# EAGLE design IMU_v0_1 (EAGLE 5.10)
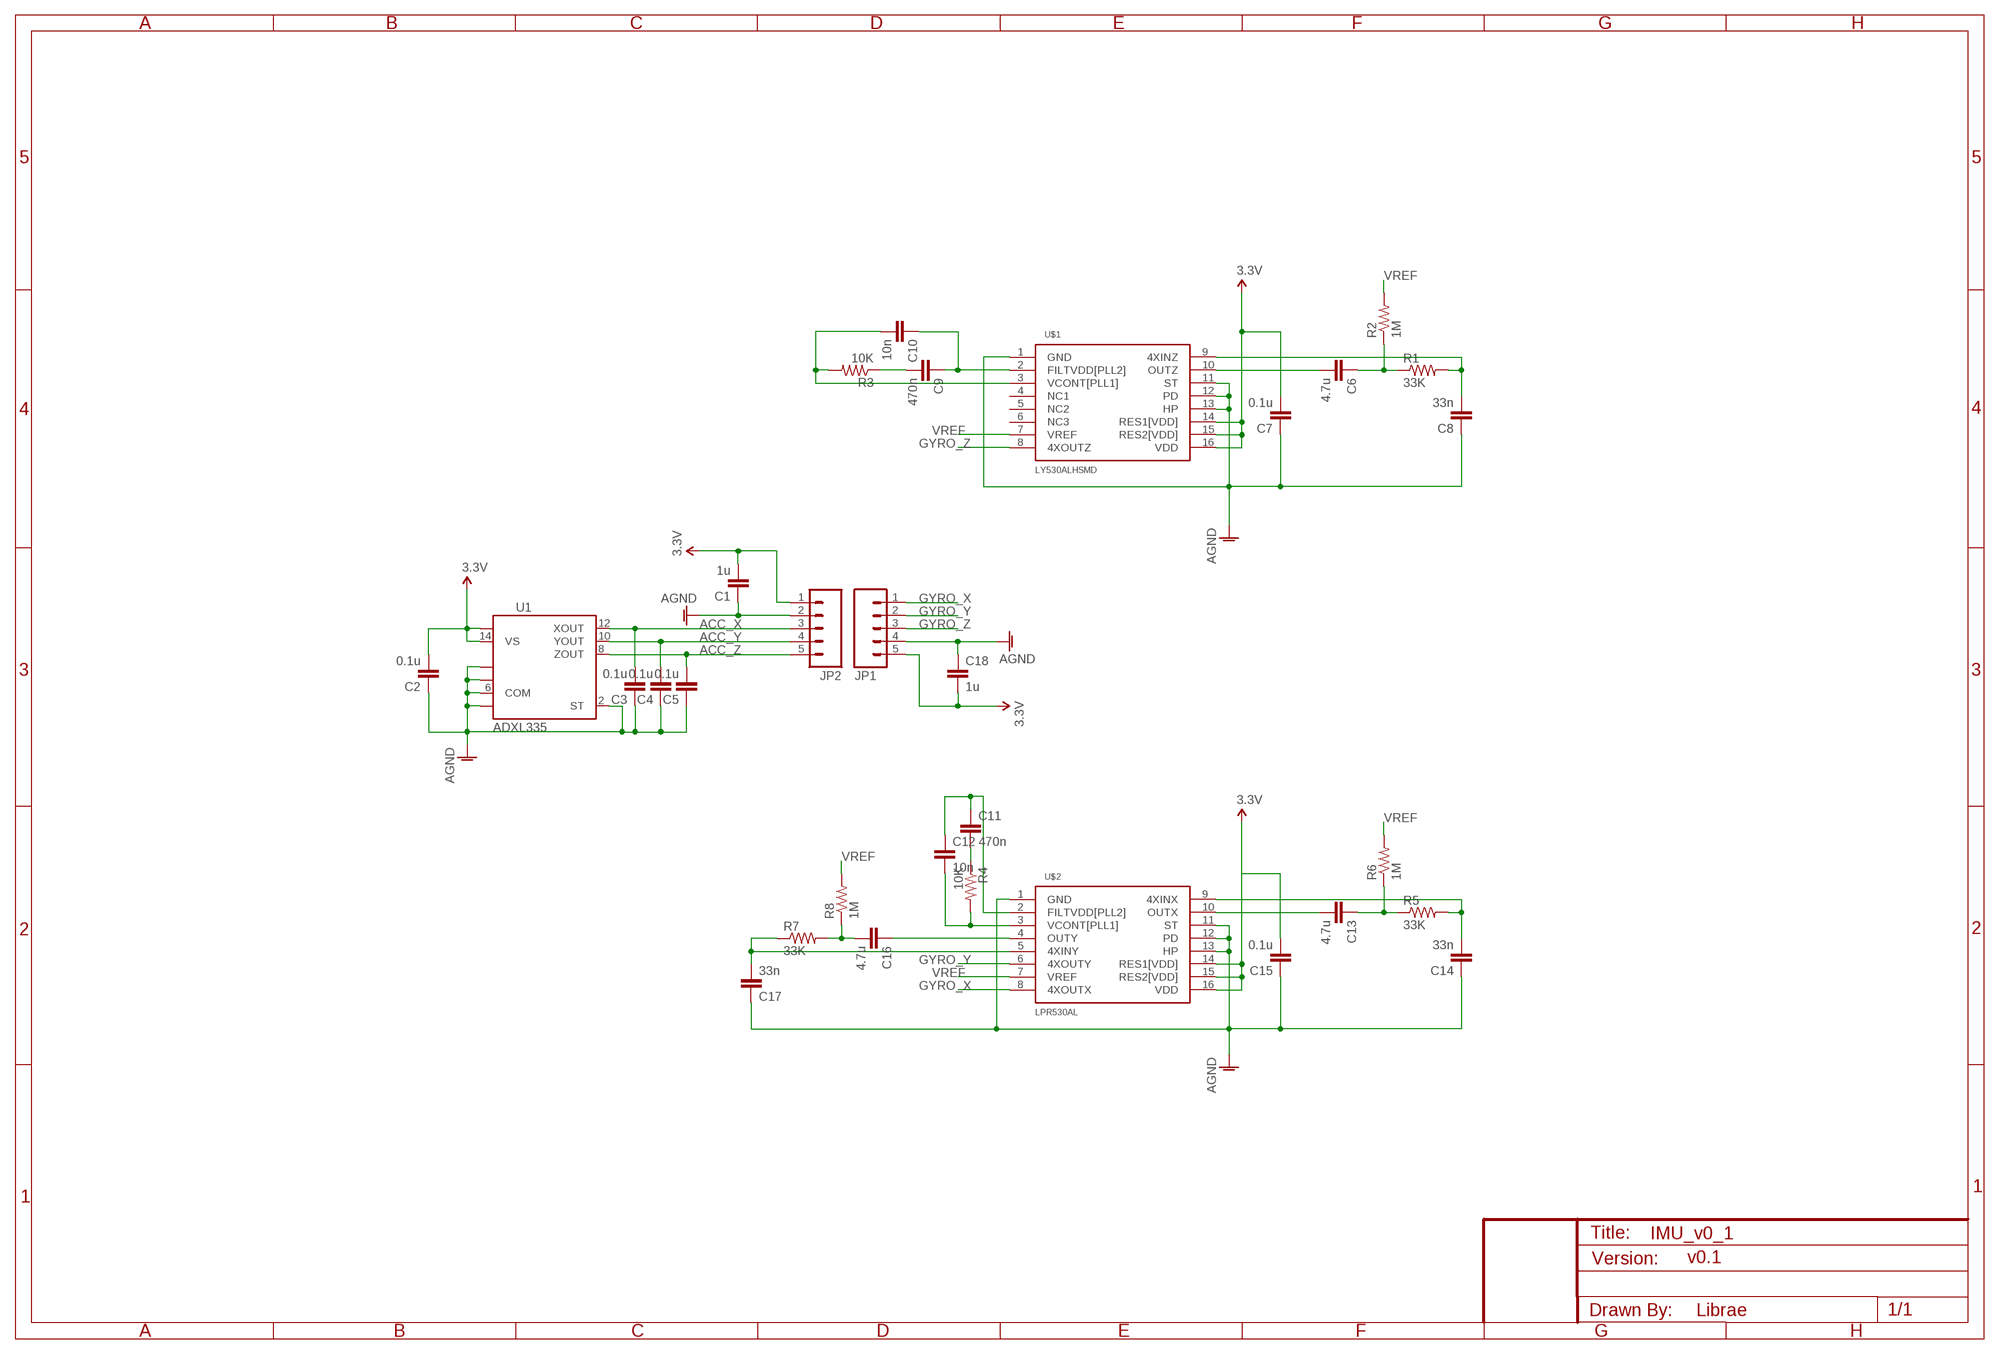
[diagram p0: schematic, sheet 1]

## Parts
C1  1u  CAP0805  [0805]
C2  0.1u  CAP0603-CAP  [0603-CAP]
C3  0.1u  CAP0603-CAP  [0603-CAP]
C4  0.1u  CAP0603-CAP  [0603-CAP]
C5  0.1u  CAP0603-CAP  [0603-CAP]
C6  4.7u  CAP0603-CAP  [0603-CAP]
C7  0.1u  CAP0603-CAP  [0603-CAP]
C8  33n  CAP0603-CAP  [0603-CAP]
C9  470n  CAP0603-CAP  [0603-CAP]
C10  10n  CAP0603-CAP  [0603-CAP]
C11  470n  CAP0603-CAP  [0603-CAP]
C12  10n  CAP0603-CAP  [0603-CAP]
C13  4.7u  CAP0603-CAP  [0603-CAP]
C14  33n  CAP0603-CAP  [0603-CAP]
C15  0.1u  CAP0603-CAP  [0603-CAP]
C16  4.7u  CAP0603-CAP  [0603-CAP]
C17  33n  CAP0603-CAP  [0603-CAP]
C18  1u  CAP0805  [0805]
JP1  M05PTH  [1X05]
JP2  M05PTH  [1X05]
R1  33K  RESISTOR0603-RES  [0603-RES]
R2  1M  RESISTOR0603-RES  [0603-RES]
R3  10K  RESISTOR0603-RES  [0603-RES]
R4  10K  RESISTOR0603-RES  [0603-RES]
R5  33K  RESISTOR0603-RES  [0603-RES]
R6  1M  RESISTOR0603-RES  [0603-RES]
R7  33K  RESISTOR0603-RES  [0603-RES]
R8  1M  RESISTOR0603-RES  [0603-RES]
U1  ADXL335  [LFCSP-16]
U$1  LY530ALHSMD  [LGA16]
U$2  LPR530AL  [LGA16-LPR530ALH]

## Nets
3.3V: C1.2 C2.2 C7.2 C15.2 C18.2 JP1.5 JP2.1 U1.14(VS) U1.15(VS) U$1.14(RES1[VDD]) U$1.15(RES2[VDD]) U$1.16(VDD) U$2.14(RES1[VDD]) U$2.15(RES2[VDD]) U$2.16(VDD)
ACC_X: C3.2 JP2.3 U1.12(XOUT)
ACC_Y: C4.2 JP2.4 U1.10(YOUT)
ACC_Z: C5.2 JP2.5 U1.8(ZOUT)
AGND: C1.1 C2.1 C3.1 C4.1 C5.1 C7.1 C8.1 C14.1 C15.1 C17.1 C18.1 JP1.4 JP2.2 U1.2(ST) U1.3(COM) U1.5(COM) U1.6(COM) U1.7(COM) U$1.1(GND) U$1.11(ST) U$1.12(PD) U$1.13(HP) U$2.1(GND) U$2.11(ST) U$2.12(PD) U$2.13(HP)
GYRO_X: JP1.1 U$2.8(4XOUTX)
GYRO_Y: JP1.2 U$2.6(4XOUTY)
GYRO_Z: JP1.3 U$1.8(4XOUTZ)
N$1: C8.2 R1.2 U$1.9(4XINZ)
N$3: C6.2 U$1.10(OUTZ)
N$4: C6.1 R1.1 R2.1
N$5: C11.1 C12.1 U$2.2(FILTVDD[PLL2])
N$7: C9.1 C10.1 U$1.2(FILTVDD[PLL2])
N$8: C9.2 R3.1
N$9: C10.2 R3.2 U$1.3(VCONT[PLL1])
N$10: C11.2 R4.1
N$11: C12.2 R4.2 U$2.3(VCONT[PLL1])
N$12: C13.2 U$2.10(OUTX)
N$13: C13.1 R5.1 R6.1
N$14: C14.2 R5.2 U$2.9(4XINX)
N$15: C16.1 U$2.4(OUTY)
N$16: C16.2 R7.2 R8.1
N$17: C17.2 R7.1 U$2.5(4XINY)
VREF: R2.2 R6.2 R8.2 U$1.7(VREF) U$2.7(VREF)
Unconnected: U$1.4(NC1) U$1.5(NC2) U$1.6(NC3)

## Notes on the sheet
- v0.1
- Librae

## Library data of the parts
C1-C18 = SparkFun:CAP: Capacitor Standard 0603 ceramic capacitor, and 0.1" leaded capacitor.
JP1 JP2 = SparkFun:M05: Header 5 Standard 5-pin 0.1" header. Use with straight break away headers (SKU : PRT-00116), right angle break away headers (PRT-00553), swiss pins (PRT-00743), machine pins (PRT-00117), and female headers (PRT-00115). Molex polarized connector foot print use with SKU : PRT-08230 with associated crimp pins and housings.
R1-R8 = MyLib:RESISTOR: Resistor Basic schematic elements and footprints for 0603, 1206, and PTH 1/10th watt (small) resistors.
U1 = MyLib:ADXL335
U$1 = MyLib:LY530ALH: LY530ALH
U$2 = MyLib:LPR530AL: LPR530AL

## Board
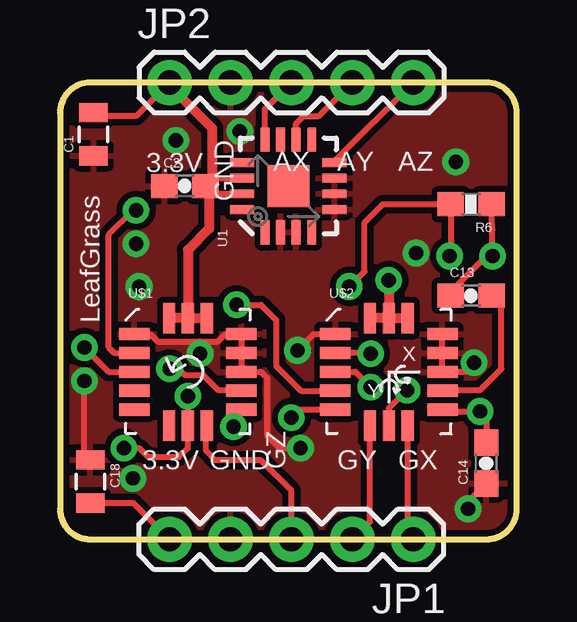
[diagram p1: board, top side]
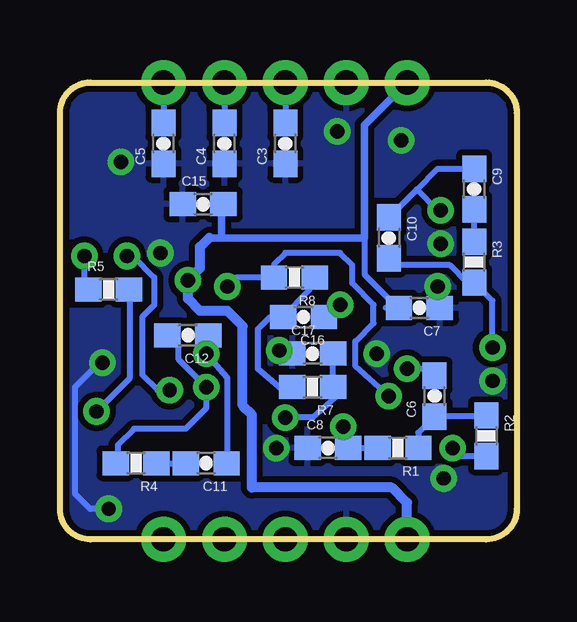
[diagram p2: board, bottom side, seen from below]

Size 19.05 x 19.05 mm. Coordinates in mm from the lower left corner, seen from the top.
Outline: 17.78,0 arc90 19.05,1.27 19.05,17.78 arc90 17.78,19.05 1.27,19.05 arc90 0,17.78 0,1.27 arc90 1.27,0 17.78,0
Copper layers (1*16): Top 0.035mm / dielectric 1.5mm / Bottom 0.035mm
Design rules "SparkFun": minimum track width 8mil, minimum drill 20mil, track to track 8mil, track to pad 8mil, pad to pad 8mil, via to via 8mil, smd to smd 8mil, copper to edge 10mil, drill to drill 8mil, minimum pad ring 12mil, minimum via ring 10mil, stop-mask expansion 4mil, vias tented up to drill 25mil, thermal gap 10mil

### Footprints (pad centres in the part's own frame; a part is rotated, then mirrored left to right if it is on the bottom)
0805 = smd 0.8 x 1.2: 1 -0.9,0; 2 0.9,0
0603-CAP = smd 1.1 x 1: 1 -0.85,0; 2 0.85,0
1X05 = drill 1.016 pad 1.88 round: 1 0,0; 2 2.54,0; 3 5.08,0; 4 7.62,0; 5 10.16,0
0603-RES = smd 1.1 x 1: 1 -0.85,0; 2 0.85,0
LFCSP-16 = smd 1.75 x 1.75: 0 0,0 | smd 1.006 x 0.37: 1 -1.928,0.975; 2 -1.928,0.325; 3 -1.928,-0.325; 4 -1.928,-0.975; 9 1.928,-0.975; 10 1.928,-0.325; 11 1.928,0.325; 12 1.928,0.975 | smd 0.37 x 1.006: 5 -0.975,-1.928; 6 -0.325,-1.928; 7 0.325,-1.928; 8 0.975,-1.928; 13 0.975,1.928; 14 0.325,1.928; 15 -0.325,1.928; 16 -0.975,1.928
LGA16 = smd 1.27 x 0.508: 1 -2.235,1.575; 2 -2.235,0.787; 3 -2.235,0; 4 -2.235,-0.787; 5 -2.235,-1.575; 9 2.235,-1.575; 10 2.235,-0.787; 11 2.235,0; 12 2.235,0.787; 13 2.235,1.575 | smd 0.508 x 1.27: 6 -0.787,-2.235; 7 0,-2.235; 8 0.787,-2.235; 14 0.787,2.235; 15 0,2.235; 16 -0.787,2.235
LGA16-LPR530ALH = smd 1.27 x 0.508: 1 -2.235,1.575; 2 -2.235,0.787; 3 -2.235,0; 4 -2.235,-0.787; 5 -2.235,-1.575; 9 2.235,-1.575; 10 2.235,-0.787; 11 2.235,0; 12 2.235,0.787; 13 2.235,1.575 | smd 0.508 x 1.27: 6 -0.787,-2.235; 7 0,-2.235; 8 0.787,-2.235; 14 0.787,2.235; 15 0,2.235; 16 -0.787,2.235

### Placement (x,y rotation side)
C1  1.4,16.89 90 top
C2  5.21,14.73 0 top
C3  9.65,16.51 90 bottom
C4  12.19,16.51 90 bottom
C5  14.73,16.51 90 bottom
C6  3.43,5.97 90 bottom
C7  4.06,9.65 180 bottom
C8  7.87,3.81 0 bottom
C9  1.78,14.61 270 bottom
C10  5.33,12.57 270 bottom
C11  12.95,3.17 180 bottom
C12  13.72,8.51 180 bottom
C13  17.14,10.16 0 top
C14  17.78,3.17 90 top
C15  13.08,13.97 0 bottom
C16  8.89,9.27 180 bottom
C17  8.51,7.75 0 bottom
C18  1.27,2.41 270 top
JP1  14.73,0 180 top
JP2  4.57,19.05 0 top
R1  4.95,3.81 180 bottom
R2  1.27,4.32 270 bottom
R3  1.78,11.56 270 bottom
R4  15.88,3.17 180 bottom
R5  17.02,10.41 0 bottom
R6  17.14,13.97 180 top
R7  8.51,6.35 180 bottom
R8  9.27,10.92 180 bottom
U1  9.53,14.73 90 top
U$1  5.33,6.99 0 top
U$2  13.72,6.99 0 top

### Tracks (layer width: path | path; a pad name or v marks a point on that pad's centre or on a via)
3.3V  (via drill 0.6)
  Top 0.254: C1.2 1.53,17.65 3.17,17.65 JP2.1 | C18.2 3.06,1.51 JP1.5 | U1.14 6.38,15.06 C2.2 6.38,14.41 U1.15
  Top 0.406: U$1.15 U$1.14 | U$1.15 U$1.16 | v13.72,10.79 13.69,10.77 13.72,10.74 U$2.15 | U$2.15 U$2.14 | U$2.15 U$2.16 | JP2.1 4.57,18.92 6.35,17.14 6.35,14.77 C2.2 6.22,14.64 6.22,12.95 5.33,12.06 U$1.15
  Bottom 0.254: 5.46,9.65 C7.2 4.95,9.65 6.35,11.05 6.35,12.57
  Bottom 0.305: 12.83,12.57 12.32,12.57 | 12.32,12.57 6.35,12.57 6.35,17.27 JP2.1 | C15.2 12.32,13.97 12.32,12.57
  Bottom 0.406: 12.83,12.57 13.21,12.19 13.21,11.3 v13.72,10.79 13.72,10.03 13.21,9.53 12.06,9.53 11.43,8.89 11.43,5.59 11.05,5.21 11.05,2.16 5.21,2.16 4.57,1.52 JP1.5
ACC_X
  Top 0.254: U1.12 8.55,17.95 JP2.3
  Bottom 0.254: JP2.3 C3.2
ACC_Y
  Top 0.254: U1.10 9.85,17.34 10.16,17.65 10.79,17.65 JP2.4
  Bottom 0.254: JP2.4 C4.2
ACC_Z
  Top 0.254: U1.8 11.45,15.77 JP2.5
  Bottom 0.254: JP2.5 C5.2
AGND  (via drill 0.6)
  Top 0.254: U$2.13 U$2.12 U$2.11 16.89,6.99 v17.27,7.37 | v9.91,7.87 10.59,8.56 U$2.1 | v17.02,1.27 17.02,1.56 C14.1 | 5.84,8.26 4.06,8.26 3.76,8.56 U$1.1 | 5.84,8.26 6.6,8.26 6.91,8.56 U$1.13 U$1.12 U$1.11 8.38,6.99 8.64,6.73 8.64,4.32 9.14,3.81 v10.03,3.81 | 5.84,8.26 v5.84,7.75 | C18.1 1.02,3.57 v1.02,6.6
  Bottom 0.254: C17.1 9.36,7.87 v9.91,7.87 | v17.27,7.37 17.4,7.37 18.41,6.35 18.41,1.91 17.78,1.27 v17.02,1.27
  other vias: 3.17,12.32 7.49,17.02 14.86,11.94 16.51,15.75 4.83,16.64 3.3,10.54 3.05,2.54
  pour Bottom (isolate 0.254): 0,1.27 0,17.78 arc-90 1.27,19.05 17.78,19.05 arc-90 19.05,17.78 19.05,1.27 arc-90 17.78,0 1.27,0 arc-90
  pour Top (isolate 0.254): 0,1.27 0,17.78 arc-90 1.27,19.05 17.78,19.05 arc-90 19.05,17.78 19.05,1.27 arc-90 17.78,0 1.27,0 arc-90
GYRO_X
  Top 0.254: 14.48,4.72 U$2.8 14.5,0.23 JP1.1
GYRO_Y
  Top 0.254: JP1.2 12.93,0.74 U$2.6
GYRO_Z
  Top 0.254: JP1.3 9.65,2.03 8.38,3.3 6.48,3.3 6.1,3.68 6.1,4.72 U$1.8
N$1  (via drill 0.6)
  Top 0.254: 7.49,5.33 U$1.9 7.24,5.08 v7.24,4.7
  Bottom 0.254: R1.2 C8.2 7.24,4.28 v7.24,4.7
N$3  (via drill 0.6)
  Top 0.254: U$1.10 7.54,6.22 6.6,6.22 5.97,6.86 5.21,6.86 4.95,7.11 v4.57,7.11
  Bottom 0.254: C6.2 3.43,7.11 v4.57,7.11
N$4
  Bottom 0.254: R1.1 4.1,4.45 C6.1 1.6,5.12 R2.1
N$5  (via drill 0.6)
  Top 0.254: v12.95,7.75 13.06,7.77 U$2.2
  Bottom 0.254: C11.1 12.06,3.26 12.06,6.73 v12.95,7.75 12.95,8.29 C12.1
N$7  (via drill 0.6)
  Top 0.254: U$1.2 2.26,7.77 2.03,8 2.03,12.7 3.05,13.72 v3.17,13.72
  Bottom 0.254: 4.17,14.59 3.3,15.46 C9.1 | 4.17,14.59 C10.1 | v3.17,13.72 3.3,13.72 4.17,14.59
N$8
  Bottom 0.254: R3.1 C9.2
N$9  (via drill 0.6)
  Top 0.254: v1.02,8 2.03,6.99 U$1.3
  Bottom 0.254: R3.2 1.65,10.58 | R3.2 1.87,10.67 2.03,10.67 2.79,11.43 5.04,11.43 C10.2 | v1.02,8 1.02,9.95 R3.2
N$10
  Bottom 0.254: R4.1 C11.2
N$11  (via drill 0.6)
  Top 0.254: U$2.3 12.32,6.99 v12.95,6.35
  Bottom 0.254: 14.48,8.81 14.44,8.85 C12.2 14.1,8.04 14.1,7.49 v12.95,6.35 12.95,5.46 13.8,4.61 15.96,4.61 16.64,3.94 16.64,3.21 R4.2
N$12
  Top 0.254: U$2.10 15.98,6.22 17.53,6.22 18.41,7.11 18.41,9.74 C13.2
N$13  (via drill 0.6)
  Top 0.254: C13.1 16.3,10.33 17.78,11.81 v18.03,11.81 18.03,12.91 R6.1
  Bottom 0.254: R5.1 17.78,10.5 18.03,10.76 v18.03,11.81
N$14  (via drill 0.6)
  Top 0.254: C14.2 17.78,5.08 v17.53,5.33 16.03,5.33 U$2.9
  Bottom 0.254: v17.53,5.33 16.13,6.73 16.13,10.38 R5.2
N$15  (via drill 0.6)
  Top 0.254: U$2.4 10.06,6.2 9.02,7.24 9.02,9.14 8.38,9.78 v7.37,9.78
  Bottom 0.254: v7.37,9.78 7.53,9.78 C16.1
N$16
  Bottom 0.254: R7.2 9.78,6.22 10.79,7.11 10.79,8.76 10.29,9.27 C16.2 9.74,9.56 9.49,9.56 8.89,10.16 8.38,10.71 R8.1
N$17  (via drill 0.6)
  Top 0.254: v9.65,5.08 9.98,5.41 U$2.5
  Bottom 0.254: C17.2 R7.1 7.41,6.06 8.51,5.08 v9.65,5.08
VREF  (via drill 0.6)
  Top 0.254: v12.06,10.54 12.7,11.18 12.7,13.21 13.46,13.97 R6.2 16.3,11.9 v16.26,11.81 | v5.33,5.97 U$1.7 5.33,3.81 4.95,3.43 3.68,3.43 3.3,3.81 v2.67,3.81 | U$2.7 13.72,5.46 v14.48,6.22
  Bottom 0.254: v12.06,10.54 11.68,10.92 R8.2 10.12,11.47 9.65,11.94 7.37,11.94 6.86,11.43 6.86,10.67 5.97,9.78 5.97,9.02 6.73,8.26 6.73,7.24 v5.33,5.97 | v14.48,6.22 14.99,6.22 15.62,6.86 15.62,9.27 15.11,9.78 15.11,10.92 16,11.81 v16.26,11.81 | v2.67,3.81 2.33,3.47 R2.2

### Text on the board
tPlace: 3.3V | AX | AY | AZ | GND | LeafGrass | 3.3V | GND | GZ | GY | GX